# Altium project smartbox.PrjPCB
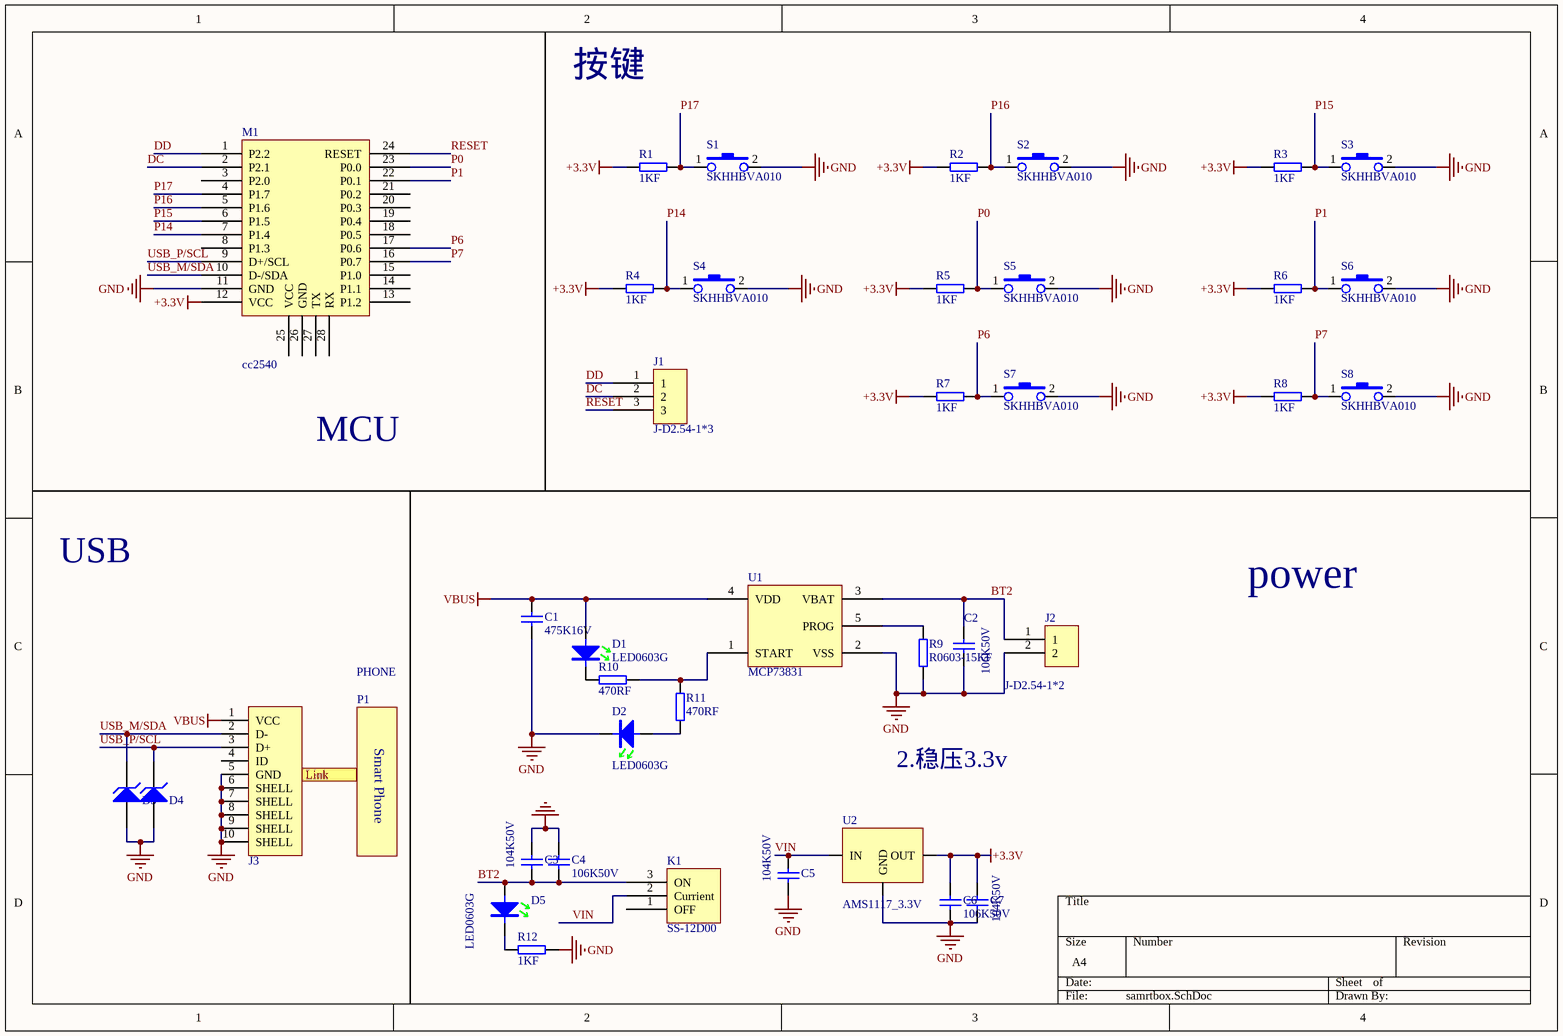
[diagram p0: samrtbox.SchDoc]
1 sheet, 40 parts. Net scope: flat (ports and power ports of the same name join across sheets).
Board file: smartbox.PcbDoc

## Sheet samrtbox.SchDoc
size A4

### Parts
C1  475K16V  [C0603]
C2  106K50V  [C0603]
C3  104K50V  [C0603]
C4  106K50V  [C0603]
C5  104K50V  [C0603]
C6  106K50V  [C0603]
C7  104K50V  [C0603]
D1  LED0603G  [D-LED0603G]
D2  LED0603G  [D-LED0603G]
D3  ESDA_TR1/0603  [HS_0603D]  (value not drawn)
D4  ESDA_TR1/0603  [HS_0603D]  (value not drawn)
D5  LED0603G  [D-LED0603G]
J1  J-D2.54-1*3  [D2.54-1*3P]
J2  J-D2.54-1*2  [D2.54-1*2P]
J3  USB-MINI-SOCKET  [MICRO-USB - 5.9]  (value not drawn)
K1  SS-12D00  [SS-12D00]
M1  cc2540  [CC25XXSM]
P1  PHONE
R1  1KF  [R0603]
R2  1KF  [R0603]
R3  1KF  [R0603]
R4  1KF  [R0603]
R5  1KF  [R0603]
R6  1KF  [R0603]
R7  1KF  [R0603]
R8  1KF  [R0603]
R9  R0603-15KF  [R0603]
R10  470RF  [R0603]
R11  470RF  [R0603]
R12  1KF  [R0603]
S1  SKHHBVA010  [S-SKHHBVA010]
S2  SKHHBVA010  [S-SKHHBVA010]
S3  SKHHBVA010  [S-SKHHBVA010]
S4  SKHHBVA010  [S-SKHHBVA010]
S5  SKHHBVA010  [S-SKHHBVA010]
S6  SKHHBVA010  [S-SKHHBVA010]
S7  SKHHBVA010  [S-SKHHBVA010]
S8  SKHHBVA010  [S-SKHHBVA010]
U1  MCP73831  [SOT23-5N]
U2  AMS1117_3.3V  [SOT-223]

### Ports
Link

### Nets
+3.3V: C6.2 C7.1 M1.12(VCC) R1.1 R2.1 R3.1 R4.1 R5.1 R6.1 R7.1 R8.1 U2.2(OUT)
GND: C1.2 C2.2 C3.1 C4.2 C5.2 C6.1 C7.2 D2.2 D3.1(A) D4.1(A) J2.2 J3.5(GND) J3.6(SHELL) J3.7(SHELL) J3.8(SHELL) J3.9(SHELL) J3.10(SHELL) M1.11(GND) R9.1 R12.2 S1.2 S2.2 S3.2 S4.2 S5.2 S6.2 S7.2 S8.2 U1.2(VSS) U2.1(GND)
VBUS: C1.1 D1.1 J3.1(VCC) U1.4(VDD)
BT2: C2.1 C3.2 C4.1 D5.1 J2.1 K1.3(ON) U1.3(VBAT)
DC: J1.2 M1.2(P2.1)
DD: J1.1 M1.1(P2.2)
P0: M1.23(P0.0) R5.2 S5.1
P1: M1.22(P0.1) R6.2 S6.1
P6: M1.17(P0.6) R7.2 S7.1
P7: M1.16(P0.7) R8.2 S8.1
P14: M1.7(P1.4) R4.2 S4.1
P15: M1.6(P1.5) R3.2 S3.1
P16: M1.5(P1.6) R2.2 S2.1
P17: M1.4(P1.7) R1.2 S1.1
RESET: J1.3 M1.24(RESET)
USB_M/SDA: D3.2(K) J3.2(D-) M1.10(D-/SDA)
USB_P/SCL: D4.2(K) J3.3(D+) M1.9(D+/SCL)
VIN: C5.1 K1.2(Currient) U2.3(IN)
NetD1_2: D1.2 R10.1
NetD2_1: D2.1 R11.1
NetD5_2: D5.2 R12.1
NetR9_2: R9.2 U1.5(PROG)
NetR10_2: R10.2 R11.2 U1.1(START)

Not connected (* = marked no-connect by the designer): J3 4(ID); K1 1(OFF); M1 3(P2.0) 8(P1.3) 13(P1.2) 14(P1.1) 15(P1.0) 18(P0.5) 19(P0.4) 20(P0.3) 21(P0.2) 25(VCC) 26(GND) 27(TX) 28(RX)

### Notes on the sheet
- 按键
- MCU
- USB
- power
- 2.稳压3.3v
- (in symbol PHONE) Smart Phone

### Library data of the parts
C1 = C0603X7R-475K16V: 贴片电容-陶瓷; 规格型号: 4.7uF±10%_16V_X7R_C0603; 生产商: 风华 三星; 供应商: *; 备注: *
C2 C4 C6 = C0603X7R-106K50V: 贴片电容-陶瓷; 规格型号: 10uF±10%_50V_X7R_C0603; 生产商: 风华 三星; 供应商: *; 备注: *
C3 C5 C7 = C0603X7R-104K50V: 贴片电容-陶瓷; 规格型号: 100nF±10%_50V_X7R_C0603; 生产商: 风华 三星; 供应商: *; 备注: *
D1 D2 D5 = DLED-0603-G: 贴片二极管-LED; 规格型号: 0603-GREEN; 货品编码: 无样品无编码; 生产商: *; 供应商: *; 备注: *
D3 D4 = D Zener: Zener Diode; Published: *; LatestRevisionDate: *; LatestRevisionNote: *; PackageReference: *; Publisher: *
J1 = J-D2.54-1*3单排
J2 = J-D2.54-1*2单排
J3 = J-USB-MINI-SOCKET: USB-A卧式插座; 供应商: *; 备注: *
K1 = SS-12D00(1P2T) 立式 柄高5MM
R1-R8 R12 = R0603-1KF: 贴片电阻-通用; 生产商: 厚声 国巨; 规格型号: 1K±1%_1/10W_±200ppm_R0603; 货品编码: 无样品无编码; 备注: *; 供应商: *
R9 = R0603-15KF: 贴片电容-通用
R10 R11 = R0603-470RF: 贴片电阻-通用; 生产商: 厚声 国巨; 规格型号: 470R±1%_1/10W_±200ppm_R0603; 货品编码: 无样品无编码; 备注: *; 供应商: *
S1-S8 = S-SKHHBVA010: 轻触按键; 生产商: 阿尔卑斯; 规格型号: S-SKHHBVA010 Tact Switch; 货品编码: 样品无编码; 备注: *; 供应商: *
U1 = MCP73831: charge IC
U2 = AMS1117-3.3V